# EAGLE schematic od855_redraw (EAGLE 8.5.1)
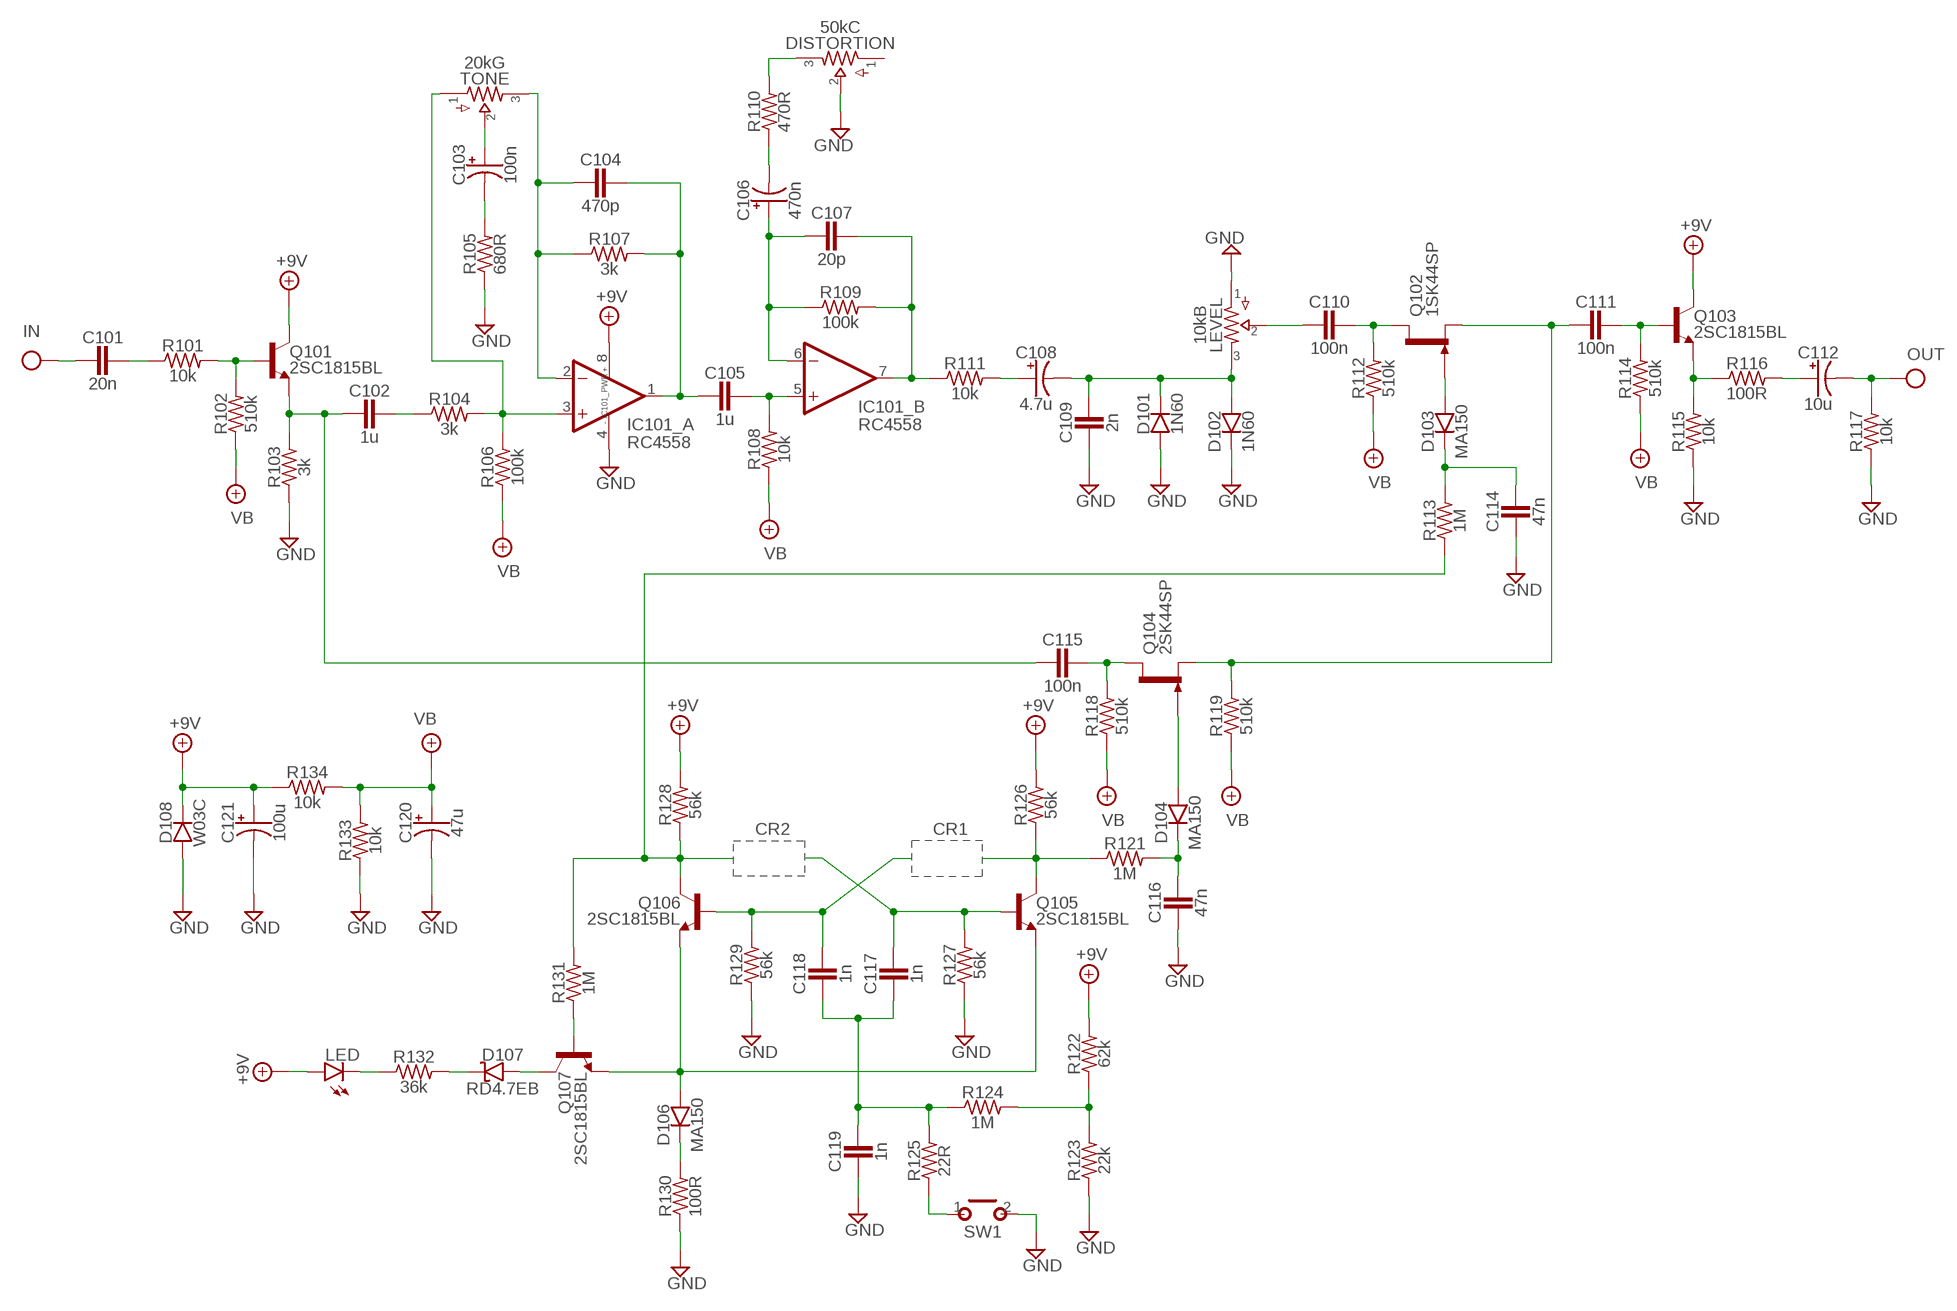
[diagram p0: schematic, sheet 1]

## Parts
C101  20n  CER/FILMBOX.1  [BOX_SMALL]
C102  1u  CER/FILMBOX.1  [BOX_SMALL]
C103  100n  0500  [050_020]
C104  470p  CER/FILMBOX.1  [BOX_SMALL]
C105  1u  CER/FILMBOX.1  [BOX_SMALL]
C106  470n  0500  [050_020]
C107  20p  CER/FILMBOX.1  [BOX_SMALL]
C108  4.7u  0500  [050_020]
C109  2n  CER/FILMBOX.1  [BOX_SMALL]
C110  100n  CER/FILMBOX.1  [BOX_SMALL]
C111  100n  CER/FILMBOX.1  [BOX_SMALL]
C112  10u  0500  [050_020]
C114  47n  CER/FILMBOX.1  [BOX_SMALL]
C115  100n  CER/FILMBOX.1  [BOX_SMALL]
C116  47n  CER/FILMBOX.1  [BOX_SMALL]
C117  1n  CER/FILMBOX.1  [BOX_SMALL]
C118  1n  CER/FILMBOX.1  [BOX_SMALL]
C119  1n  CER/FILMBOX.1  [BOX_SMALL]
C120  47u  0500  [050_020]
C121  100u  0500  [050_020]
D101  1N60  DO35.2  [DO35-2]
D102  1N60  DO35.2  [DO35-2]
D103  MA150  DO35.2  [DO35-2]
D104  MA150  DO35.2  [DO35-2]
D106  MA150  DO35.2  [DO35-2]
D107  RD4.7EB  ZENER.2  [DO41-2]
D108  W03C  DO35.2  [DO35-2]
DISTORTION  50kC  POTS16MM  [16MM]
IC101  RC4558  DUALTH  [DIL0]
LED  LED  [3MM_D]
LEVEL  10kB  POTS16MM  [16MM]
Q101  2SC1815BL  2N3904  [TO92-]
Q102  1SK44SP  2N5457  [TO92-]
Q103  2SC1815BL  2N3904  [TO92-]
Q104  2SK44SP  2N5457  [TO92-]
Q105  2SC1815BL  2SC828A  [TO92-]
Q106  2SC1815BL  2SC828A  [TO92-]
Q107  2SC1815BL  2SC828A  [TO92-]
R101  10k  R_.3B  [R0207/3]
R102  510k  R_.3B  [R0207/3]
R103  3k  R_.3B  [R0207/3]
R104  3k  R_.3B  [R0207/3]
R105  680R  R_.3B  [R0207/3]
R106  100k  R_.3B  [R0207/3]
R107  3k  R_.3B  [R0207/3]
R108  10k  R_.3B  [R0207/3]
R109  100k  R_.3B  [R0207/3]
R110  470R  R_.3B  [R0207/3]
R111  10k  R_.3B  [R0207/3]
R112  510k  R_.3B  [R0207/3]
R113  1M  R_.3B  [R0207/3]
R114  510k  R_.3B  [R0207/3]
R115  10k  R_.3B  [R0207/3]
R116  100R  R_.3B  [R0207/3]
R117  10k  R_.3B  [R0207/3]
R118  510k  R_.3B  [R0207/3]
R119  510k  R_.3B  [R0207/3]
R121  1M  R_.3B  [R0207/3]
R122  62k  R_.3B  [R0207/3]
R123  22k  R_.3B  [R0207/3]
R124  1M  R_.3B  [R0207/3]
R125  22R  R_.3B  [R0207/3]
R126  56k  R_.3B  [R0207/3]
R127  56k  R_.3B  [R0207/3]
R128  56k  R_.3B  [R0207/3]
R129  56k  R_.3B  [R0207/3]
R130  100R  R_.3B  [R0207/3]
R131  1M  R_.3B  [R0207/3]
R132  36k  R_.3B  [R0207/3]
R133  10k  R_.3B  [R0207/3]
R134  10k  R_.3B  [R0207/3]
SW1  MOMENTARY  [SPST]
TONE  20kG  POTS16MM  [16MM]

## Nets
+9V: C121.+ D108.C IC101.8(_PWR:V+) LED.ANODE(A) Q101.1(C) Q103.1(C) R122.2 R126.2 R128.2 R134.1
GND: C109.2 C114.2 C116.2 C119.2 C120.- C121.- D101.A D102.C D108.A DISTORTION.2 IC101.4(_PWR:V-) LEVEL.1 R103.1 R105.1 R115.1 R117.1 R123.1 R127.1 R129.1 R130.1 R133.1 SW1.2(S)
IN: C101.2
N$3: Q101.2(B) R101.2 R102.2
N$4: C102.2 C115.2 Q101.3(E) R103.2
N$5: C102.1 R104.1
N$6: C103.+ TONE.2
N$7: IC101.3(_A:+IN) R104.2 R106.2 TONE.1
N$8: C103.- R105.2
N$9: C104.2 IC101.2(_A:-IN) R107.1 TONE.3
N$10: C104.1 C105.2 IC101.1(_A:OUT) R107.2
N$11: C106.+ C107.2 IC101.6(_B:-IN) R109.1
N$12: C105.1 IC101.5(_B:+IN) R108.2
N$13: C107.1 IC101.7(_B:OUT) R109.2 R111.1
N$14: C108.+ R111.2
N$15: C108.- C109.1 D101.C D102.A LEVEL.3
N$16: C110.2 LEVEL.2
N$17: C110.1 Q102.3(D) R112.2
N$18: C111.2 Q102.2(S) Q104.2(S) R119.2
N$19: D103.A Q102.1(G)
N$20: C114.1 D103.C R113.2
N$21: D104.A Q104.1(G)
N$22: C116.1 D104.C R121.2
N$23: C111.1 Q103.2(B) R114.2
N$24: Q103.3(E) R115.2 R116.1
N$25: C112.+ R116.2
N$27: C115.1 Q104.3(D) R118.2
N$29: Q106.2(C) R113.1 R128.1 R131.2
N$30: Q107.1(B) R131.1
N$31: Q105.2(C) R121.1 R126.1
N$32: C118.1 Q106.1(B) R129.2
N$33: C101.1 R101.1
N$34: C117.1 Q105.1(B) R127.2
N$35: D106.A Q105.3(E) Q106.3(E) Q107.3(E)
N$36: C117.2 C118.2 C119.1 R124.1 R125.2
N$37: D106.C R130.2
N$38: R122.1 R123.2 R124.2
N$39: R125.1 SW1.1(P)
N$40: LED.P$1(C) R132.1
N$41: D107.C R132.2
N$42: D107.A Q107.2(C)
N$43: DISTORTION.3 R110.2
N$44: C106.- R110.1
OUT: C112.- R117.2
VB: C120.+ R102.1 R106.1 R108.1 R112.1 R114.1 R118.1 R119.1 R133.2 R134.2
Unconnected: DISTORTION.1

## Notes on the sheet
- CR2 | CR1

## Library data of the parts
C101 C102 C104 C105 C107 C109-C111 C114-C119 = pedals-capacitors-film:CER/FILM: 47 - 120pF Xicon Ceramic Disc 2.5mm lead spacing
C103 C106 C108 C112 C120 C121 = pedals-capacitors-elec:050
D101-D104 D106 D108 = pedals-diodes:DO35: DO-35 Package Diodes: 1N914
D107 = pedals-diodes:ZENER
DISTORTION LEVEL TONE = pedals-potentiometers:POTS
IC101 = pedals-integrated circuits:DUAL: OP AMP
LED = pedals-diodes:LED
Q101 Q103 = pedals-transistors:2N3904: NPN Transistor
Q102 Q104 = pedals-transistors:2N5457: N-CHANNEL JFET
Q105-Q107 = pedals-transistors:2SC828A
R101-R119 R121-R134 = pedals-resistors:R_
SW1 = pedals-switches:MOMENTARY